# Altium schematic sheet Sheet3.SchDoc
size A; SheetNumber: 3; SheetTotal: 3
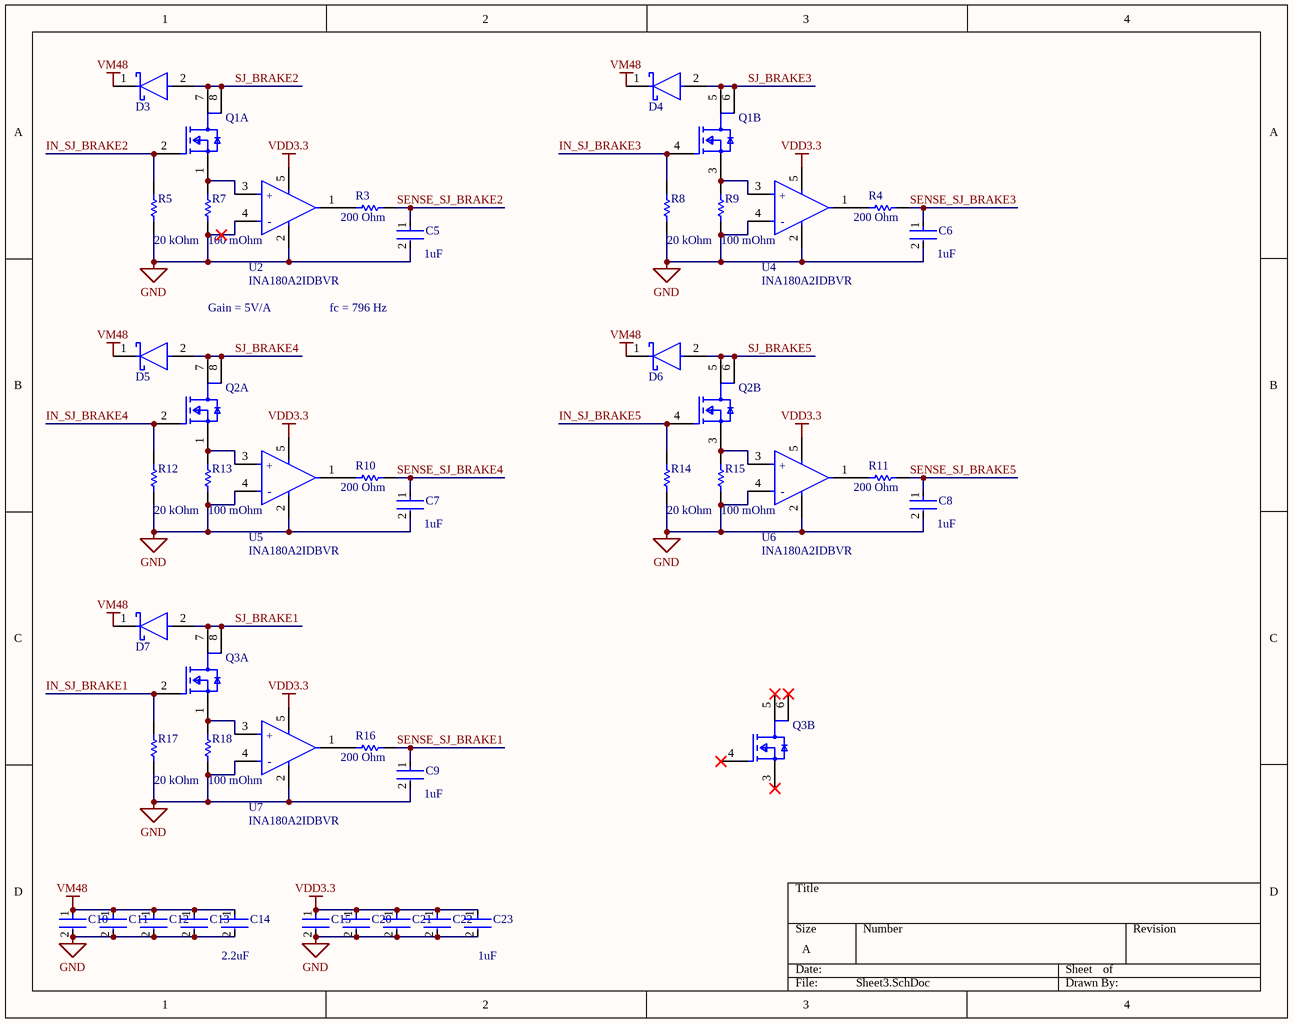
[diagram p0: Sheet3.SchDoc]

## Parts
C5  value 1uF  [FP-GRM15-0_1-MFG]  (hidden comment: GRM155R61A105KE15D)
C6  value 1uF  [FP-GRM15-0_1-MFG]  (hidden comment: GRM155R61A105KE15D)
C7  value 1uF  [FP-GRM15-0_1-MFG]  (hidden comment: GRM155R61A105KE15D)
C8  value 1uF  [FP-GRM15-0_1-MFG]  (hidden comment: GRM155R61A105KE15D)
C9  value 1uF  [FP-GRM15-0_1-MFG]  (hidden comment: GRM155R61A105KE15D)
C10  12101C225KAT2A  [FP-1210-L_3_3_0_4-W_2_5_0-MFG]  (value not drawn)
C11  12101C225KAT2A  [FP-1210-L_3_3_0_4-W_2_5_0-MFG]  (value not drawn)
C12  12101C225KAT2A  [FP-1210-L_3_3_0_4-W_2_5_0-MFG]  (value not drawn)
C13  12101C225KAT2A  [FP-1210-L_3_3_0_4-W_2_5_0-MFG]  (value not drawn)
C14  Capacitance: 2.2uF  [FP-1210-L_3_3_0_4-W_2_5_0-MFG]  (hidden comment: 12101C225KAT2A)
C15  GRM155R61A105KE15D  [FP-GRM15-0_1-MFG]  (value not drawn)
C20  GRM155R61A105KE15D  [FP-GRM15-0_1-MFG]  (value not drawn)
C21  GRM155R61A105KE15D  [FP-GRM15-0_1-MFG]  (value not drawn)
C22  GRM155R61A105KE15D  [FP-GRM15-0_1-MFG]  (value not drawn)
C23  value 1uF  [FP-GRM15-0_1-MFG]  (hidden comment: GRM155R61A105KE15D)
D3  VS-10MQ100NTRPBF  [FP-95400-MFG]  (value not drawn)
D4  VS-10MQ100NTRPBF  [FP-95400-MFG]  (value not drawn)
D5  VS-10MQ100NTRPBF  [FP-95400-MFG]  (value not drawn)
D6  VS-10MQ100NTRPBF  [FP-95400-MFG]  (value not drawn)
D7  VS-10MQ100NTRPBF  [FP-95400-MFG]  (value not drawn)
Q1  SI4946CDY-T1-GE3  [FP-84021-IPC_B]  (value not drawn)  (parts A,B of 2)
Q2  SI4946CDY-T1-GE3  [FP-84021-IPC_B]  (value not drawn)  (parts A,B of 2)
Q3  SI4946CDY-T1-GE3  [FP-84021-IPC_B]  (value not drawn)  (parts A,B of 2)
R3  value 200 Ohm  [RESC1005X40X25LL05T10]  (hidden comment: RC0402FR-07200RL)
R4  value 200 Ohm  [RESC1005X40X25LL05T10]  (hidden comment: RC0402FR-07200RL)
R5  value 20 kOhm  [RESC1005X40X25LL05T10]  (hidden comment: RC0402FR-0720KL)
R7  value 100 mOhm  [RESC3216X70X50LL05T20]  (hidden comment: ERJ-L08KF10CV)
R8  value 20 kOhm  [RESC1005X40X25LL05T10]  (hidden comment: RC0402FR-0720KL)
R9  value 100 mOhm  [RESC3216X70X50LL05T20]  (hidden comment: ERJ-L08KF10CV)
R10  value 200 Ohm  [RESC1005X40X25LL05T10]  (hidden comment: RC0402FR-07200RL)
R11  value 200 Ohm  [RESC1005X40X25LL05T10]  (hidden comment: RC0402FR-07200RL)
R12  value 20 kOhm  [RESC1005X40X25LL05T10]  (hidden comment: RC0402FR-0720KL)
R13  value 100 mOhm  [RESC3216X70X50LL05T20]  (hidden comment: ERJ-L08KF10CV)
R14  value 20 kOhm  [RESC1005X40X25LL05T10]  (hidden comment: RC0402FR-0720KL)
R15  value 100 mOhm  [RESC3216X70X50LL05T20]  (hidden comment: ERJ-L08KF10CV)
R16  value 200 Ohm  [RESC1005X40X25LL05T10]  (hidden comment: RC0402FR-07200RL)
R17  value 20 kOhm  [RESC1005X40X25LL05T10]  (hidden comment: RC0402FR-0720KL)
R18  value 100 mOhm  [RESC3216X70X50LL05T20]  (hidden comment: ERJ-L08KF10CV)
U2  INA180A2IDBVR  [FP-DBV0005A-MFG]
U4  INA180A2IDBVR  [FP-DBV0005A-MFG]
U5  INA180A2IDBVR  [FP-DBV0005A-MFG]
U6  INA180A2IDBVR  [FP-DBV0005A-MFG]
U7  INA180A2IDBVR  [FP-DBV0005A-MFG]

## Nets
GND: C5.2 C6.2 C7.2 C8.2 C9.2 C10.2 C11.2 C12.2 C13.2 C14.2 C15.2 C20.2 C21.2 C22.2 C23.2 R5.1 R7.1 R8.1 R9.1 R12.1 R13.1 R14.1 R15.1 R17.1 R18.1 U2.2(GND) U2.4(IN-) U4.2(GND) U4.4(IN-) U5.2(GND) U5.4(IN-) U6.2(GND) U6.4(IN-) U7.2(GND) U7.4(IN-)
VDD3.3: C15.1 C20.1 C21.1 C22.1 C23.1 U2.5(VS) U4.5(VS) U5.5(VS) U6.5(VS) U7.5(VS)
VM48: C10.1 C11.1 C12.1 C13.1 C14.1 D3.1(C) D4.1(C) D5.1(C) D6.1(C) D7.1(C)
IN_SJ_BRAKE1: Q3.2(G1) R17.2
IN_SJ_BRAKE2: Q1.2(G1) R5.2
IN_SJ_BRAKE3: Q1.4(G2) R8.2
IN_SJ_BRAKE4: Q2.2(G1) R12.2
IN_SJ_BRAKE5: Q2.4(G2) R14.2
SENSE_SJ_BRAKE1: C9.1 R16.2
SENSE_SJ_BRAKE2: C5.1 R3.2
SENSE_SJ_BRAKE3: C6.1 R4.2
SENSE_SJ_BRAKE4: C7.1 R10.2
SENSE_SJ_BRAKE5: C8.1 R11.2
SJ_BRAKE1: D7.2(A) Q3.7(D1) Q3.8(D1)
SJ_BRAKE2: D3.2(A) Q1.7(D1) Q1.8(D1)
SJ_BRAKE3: D4.2(A) Q1.5(D2) Q1.6(D2)
SJ_BRAKE4: D5.2(A) Q2.7(D1) Q2.8(D1)
SJ_BRAKE5: D6.2(A) Q2.5(D2) Q2.6(D2)
NetQ1_1: Q1.1(S1) R7.2 U2.3(IN+)
NetQ1_3: Q1.3(S2) R9.2 U4.3(IN+)
NetQ2_1: Q2.1(S1) R13.2 U5.3(IN+)
NetQ2_3: Q2.3(S2) R15.2 U6.3(IN+)
NetQ3_1: Q3.1(S1) R18.2 U7.3(IN+)
NetR3_1: R3.1 U2.1(OUT)
NetR4_1: R4.1 U4.1(OUT)
NetR10_1: R10.1 U5.1(OUT)
NetR11_1: R11.1 U6.1(OUT)
NetR16_1: R16.1 U7.1(OUT)

Not connected (* = marked no-connect by the designer): Q3 3(S2)* 4(G2)* 5(D2)* 6(D2)*

## Notes on the sheet
- Gain = 5V/A
- fc = 796 Hz
- (in symbol CMP-04895-000287-1) +; -

## Library data of the parts
C5-C9 C15 C20-C23 = CMP-2008-04556-2: CAP CER 1UF 10V X5R 0402; Manufacturer: Murata; Material: Ceramic; Tolerance: 10%; Temperature Coefficient: 15%; Octopart: https://octopart.com/grm155r61a105ke15d-murata-197442; Manufacturer Part Number: GRM155R61A105KE15D; Lead Free: Yes; ComponentLink2Description: Datasheet; Temperature: -55°C to +85°C; Temperature Range High: +85°C; Height: 0.55mm; Capacitance: 1uF; Ipc Land Pattern Name: CAPC10050X50; ComponentLink2URL: https://search.murata.co.jp/Ceramy/image/img/A01X/G101/ENG/GRM155R61A105KE15-01A.pdf; Temperature Range Low: -55°C; Device Class L2: Capacitors; Voltage Rating: 10V; RoHS: TRUE; Device Class L1: Passive Components; Device Class L3: Ceramic Capacitors; Temperature Characteristic: X5R; Mouser Description: 0402 1 uF 10 V ±10% Tolerance X5R Surface Mount Multilayer Ceramic Capacitor; Automotive: No; Package: GRM15-0.1; Digikey Description: CAP CER 1UF 10V X5R 0402; Category: Cap; LCSC: C52923
  C15 C20-C22: Value: 1uF
C10-C14 = CMP-1038-02104-3: General Purpose Ceramic Capacitor, 1210, 2.2uF, 10%, X7R, 15%, 100V; Dissipation Factor: 2.5%; Number of Pins: 2; Lead Free: Lead Free; Voltage Rating: 100V; Min Operating Temperature: -55°C; Height: 2.79mm; Length: 3.2mm; RoHS Compliant: Yes; Case/Package: 1210; Max Operating Temperature: 125°C; Radiation Hardening: No; Series: -; Case Code (Metric): 3225; Dielectric: X7R; Voltage Rating (DC): 100V; Packaging: Tape and Reel; Width: 2.5mm; Thickness: 0.11inch; Depth: 2.5mm; Contact Plating: Tin; REACH SVHC: No SVHC; Tolerance: 10%; Construction: Flat; Case Code (Imperial): 1210; Mount: Surface Mount; Package Quantity: 1; Termination: SMD/SMT; Voltage: 100V; LCSC: C338133
  C10-C13: Capacitance: 2.2uF
D3-D7 = CMP-02539-000001-1: DIODE SCHOTTKY 100V 1A SMA; Manufacturer: Vishay; Forward Current: 1.5A; Max Surge Forward Current: 30A; Standoff Height: 0mm; Value: 38pF; Max Junction Temp: +150°C; Peak Reverse Current: 0.1mA; Octopart: https://octopart.com/vs-10mq100ntrpbf-vishay-44340924; Max Repetitive Reverse Voltage: 100V; ComponentLink2Description: Datasheet; ComponentLink2URL: http://www.vishay.com/docs/94119/vs-10mq100ntrpbf.pdf; Reverse Voltage: 100V; Digikey Description: DIODE SCHOTTKY 100V 1A SMA; Mouser Description: DIODE SCHOTTKY 100V 1A SMA; Lead Free: Yes; Device Class L2: Diodes; Temperature Range Low: -55°C; Package: 95400; Height: 2.29mm; Capacitance: 38pF; Device Class L1: Discrete Semiconductors; Footprint Url: https://www.vishay.com/docs/95400/sma.pdf; Temperature: -55°C to +150°C; Temperature Range High: +150°C; RoHS: TRUE; Category: Diode; Manufacturer Part Number: VS-10MQ100NTRPBF; Device Class L3: Schottky Diodes; Automotive: No; LCSC: C14996
Q1-Q3 = CMP-02550-000227-1: MOSFET N-CHAN DUAL 60V SO-8; Manufacturer: Vishay; Reverse Recovery Charge: 12nC; Threshold Vgs Min: 1V; Drain To Source Resistance: 0.033Ω; Threshold Vgs Max: 3V; Continuous Drain Current: 5.2A; Depletion Mode: False; Typ Forward Diode Voltage: 0.85V; Power Dissipation: 2W; Number Of N Channels: 2; Turn On Delay Time: 8ns; Input Capacitace At Vds: 350pF @ 30V; Turn Off Delay Time: 16ns; Gate Charge At Vgs: 5.1nC @ 10V; Transconductance: 17S; Max Junction Temp: +150°C; Rthja Max: 58°C/W; Max Forward Diode Voltage: 1.2V; Standoff Height: 0.1mm; Pulse Drain Current: 25A; Reverse Recovery Time: 21ns; Gate To Source Voltage: 20V; Rds On Max: 68mR; Input Capacitance: 415pF; Drain to Source Voltage (Vdss): 100V; Continuous Drain Current (ID): 4A; FET Type: 2 N-Channel; Footprint Url: https://www.vishay.com/docs/84021/84021.pdf; Automotive: No; Height: 1.75mm; Package: 84021; Octopart: https://octopart.com/si4946cdy-t1-ge3-vishay-87943198; ComponentLink2URL: https://www.vishay.com/docs/75642/si4946cdy.pdf; Device Class L1: Discrete Semiconductors; RoHS: TRUE; Digikey Description: MOSFET N-CHAN DUAL 60V SO-8; Lead Free: Yes; Manufacturer Part Number: SI4946CDY-T1-GE3; Temperature Range Low: -55°C; Drain To Source Voltage: 60V; Number Of Channels: 2; Temperature Range High: +150°C; Drain To Source Breakdown Voltage: 60V; Device Class L3: MOSFETs; Ipc Land Pattern Name: SOIC127P600X155-8; ComponentLink2Description: Datasheet; Category: Trans; Device Class L2: Transistors; Temperature: -55°C to +150°C; Supplier 1: Arrow Electronics; Supplier Part Number 1: AO4892; Stock 1: 12000; Pricing 1: 3000=0.29410 (USD); Mount: Surface Mount; Case/Package: SOIC; Min Operating Temperature: -55°C; Max Operating Temperature: 150°C; Packaging: Tape and Reel; Max Power Dissipation: 2W; Series: -; RoHS Compliant: Yes; ComponentLink1URL: https://datasheet.ciiva.com/15044/ao4892-15044310.pdf?src-supplier=Digi-Key; ComponentLink1Description: https://datasheet.ciiva.com/15044/ao4892-15044310.pdf?src-supplier=Digi-Key; LCSC: C357830
R3 R4 R10 R11 R16 = CMP-2002-07498-1: Manufacturer: Yageo / Phycomp; Part Number: RC0402FR-07200RL; LCSC: C25087
R5 R8 R12 R14 R17 = CMP-2002-07501-1: Manufacturer: Yageo / Phycomp; Part Number: RC0402FR-0720KL; LCSC: C25765
R7 R9 R13 R15 R18 = CMP-2003-00708-1: Manufacturer: Panasonic; Part Number: ERJ-L08KF10CV; LCSC: C2903496
U2 U4-U7 = CMP-04895-000287-1: IC CURR SENSE 1 CIRCUIT SOT23-5; Operating Supply Current: 260uA; -3db Bandwidth: 350kHz; Slew Rate: 2V/µs; Number of Circuits: 1; Input Offset Voltage (Vos): 100uV; Input Bias Current: 100nA; Mount: Surface Mount; Max Operating Temperature: 125°C; Packaging: Tape and Reel; Min Operating Temperature: -40°C; Case/Package: SOT-23-5; RoHS Compliant: Yes; LCSC: C192764